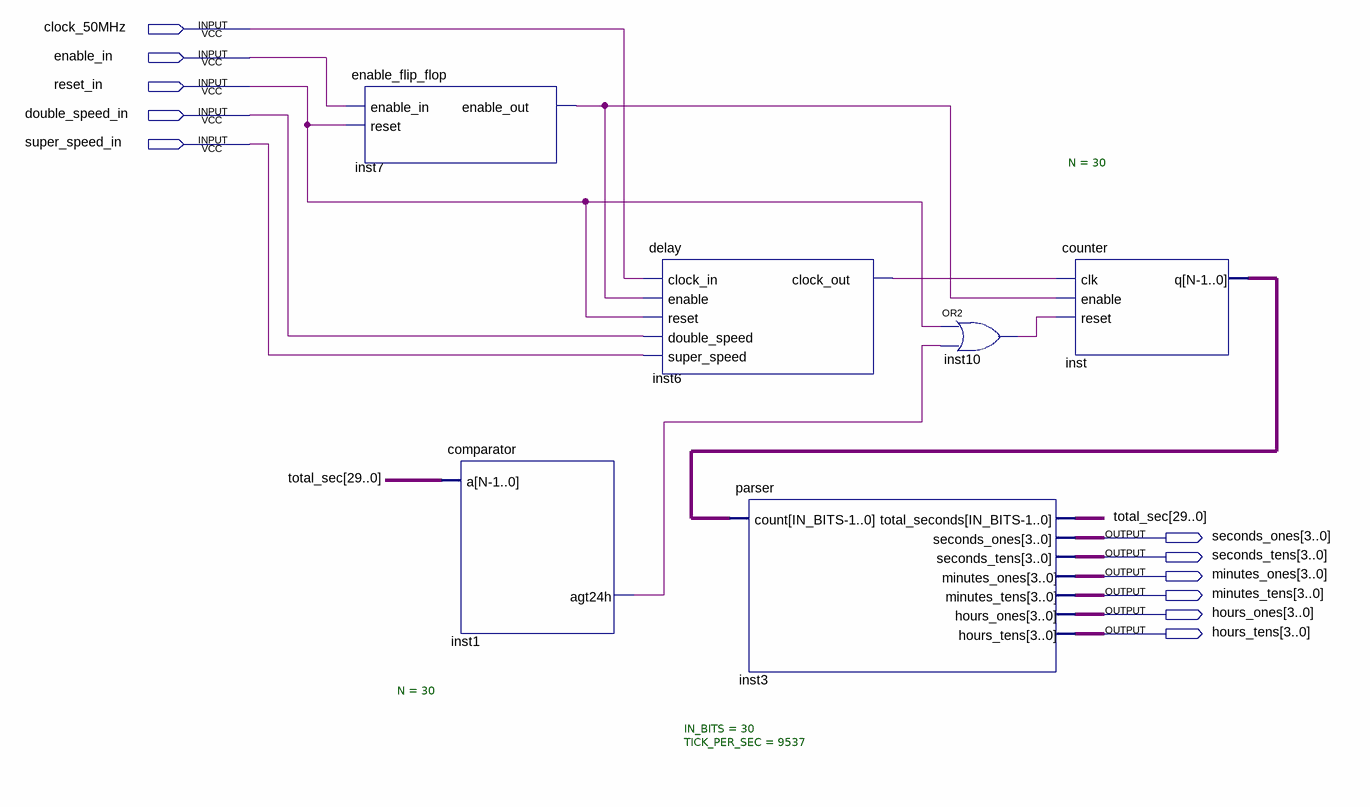
[diagram p0: schematic sheet]
// Quartus schematic parsed_clock.bdf as structural Verilog: 6 symbols, 11 pins
module parsed_clock (
  input  clock_50MHz,
  input  enable_in,
  input  reset_in,
  input  double_speed_in,
  input  super_speed_in,
  output [3:0] seconds_ones,
  output [3:0] seconds_tens,
  output [3:0] minutes_ones,
  output [3:0] minutes_tens,
  output [3:0] hours_ones,
  output [3:0] hours_tens
);

  wire inst1_agt24h, inst6_clock_out, inst7_enable_out, inst10_out;
  wire [29:0] inst_q, total_sec;

  enable_flip_flop inst7 (.reset(reset_in), .enable_in(enable_in), .enable_out(inst7_enable_out));
  comparator #(.N(30)) inst1 (.a(total_sec), .agt24h(inst1_agt24h));
  delay inst6 (
    .double_speed(double_speed_in), .super_speed(super_speed_in), .clock_in(clock_50MHz),
    .enable(inst7_enable_out), .reset(reset_in), .clock_out(inst6_clock_out));
  parser #(.IN_BITS(30), .TICK_PER_SEC(9537)) inst3 (
    .count(inst_q), .total_seconds(total_sec), .seconds_ones(seconds_ones), .seconds_tens(seconds_tens),
    .minutes_ones(minutes_ones), .minutes_tens(minutes_tens), .hours_ones(hours_ones), .hours_tens(hours_tens));
  or inst10 (inst10_out, reset_in, inst1_agt24h);
  counter #(.N(30)) inst (.clk(inst6_clock_out), .reset(inst10_out), .enable(inst7_enable_out), .q(inst_q));
endmodule
